# Altium project gtrack_anchor_v2.PrjPcb
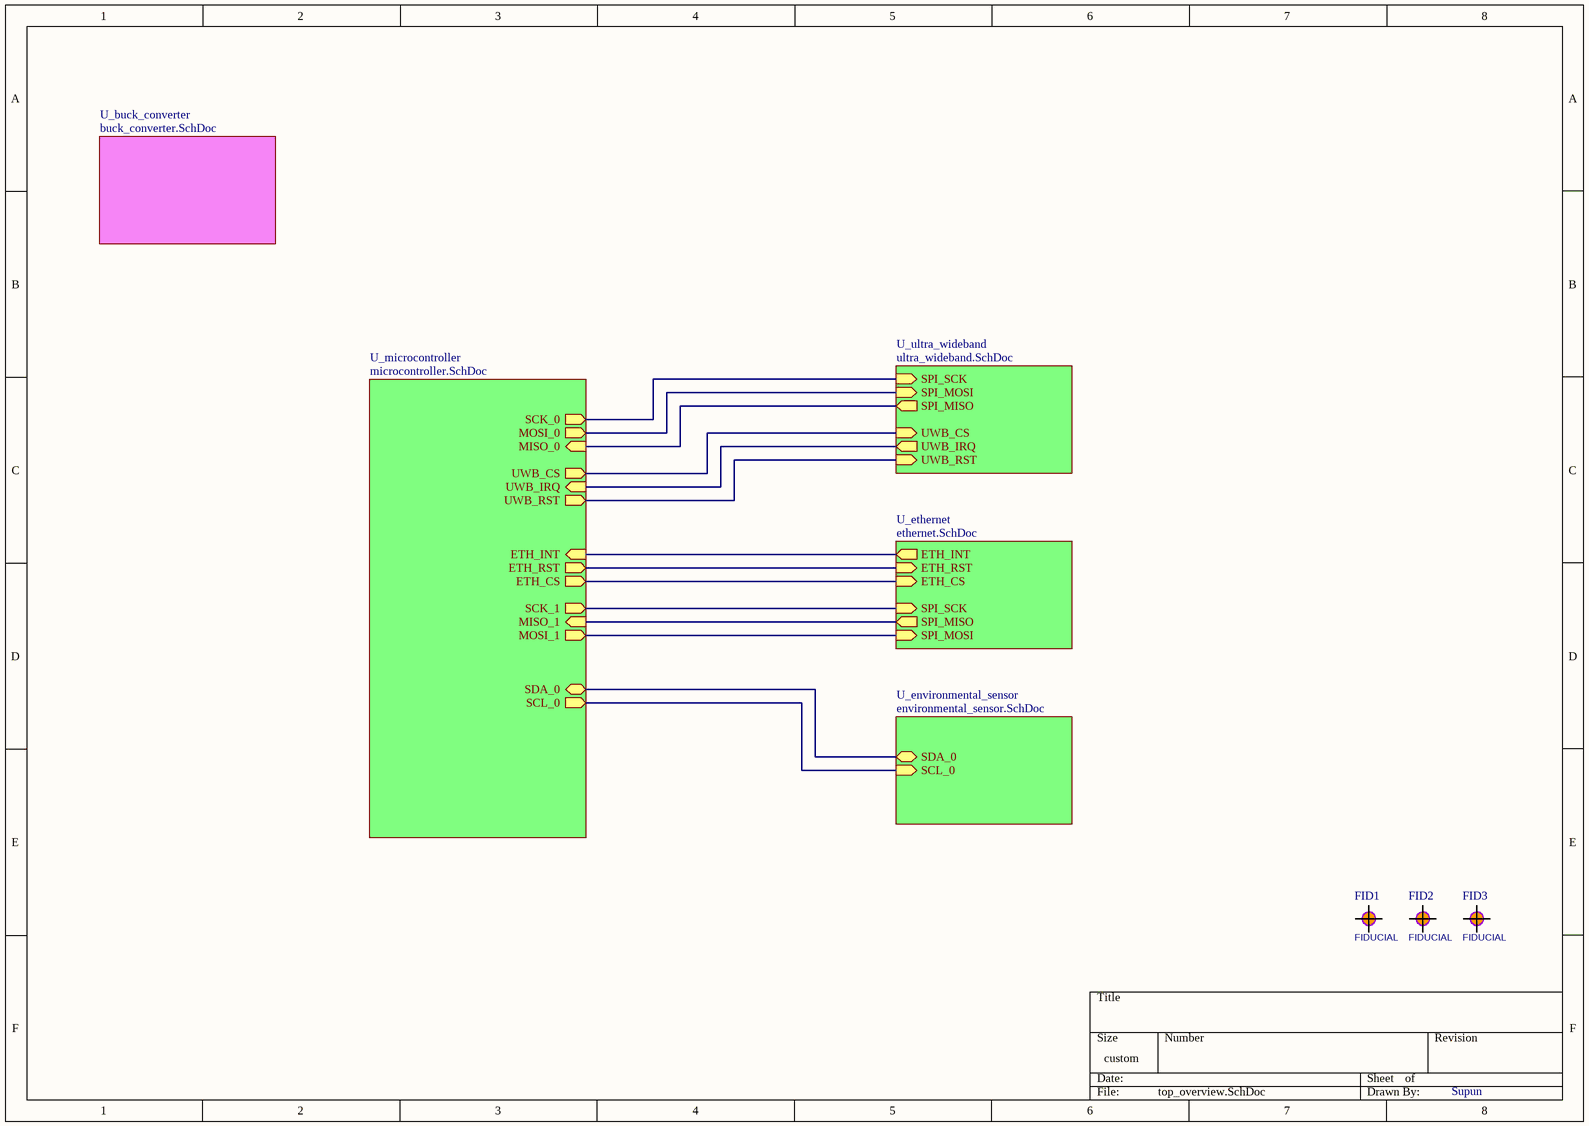
[diagram p0: top_overview.SchDoc]
6 sheets, 148 parts. Net scope: hierarchical (ports join the sheet entries above them; power ports are global).
Board file: GTrackAnchor_v2.PcbDoc
Sheets:
  top_overview.SchDoc
    U_microcontroller = microcontroller.SchDoc
    U_ultra_wideband = ultra_wideband.SchDoc
    U_ethernet = ethernet.SchDoc
    U_buck_converter = buck_converter.SchDoc
    U_environmental_sensor = environmental_sensor.SchDoc

## Sheet top_overview.SchDoc
size 297 x 209 mm; DrawnBy: Supun; Engineer: Supun; Organization: C3

### Parts
FID1  FIDUCIAL  [FIDUCIAL1SM2]  (no BOM)
FID2  FIDUCIAL  [FIDUCIAL1SM2]  (no BOM)
FID3  FIDUCIAL  [FIDUCIAL1SM2]  (no BOM)

### Sub-sheets
U_buck_converter = buck_converter.SchDoc: no entries
U_environmental_sensor = environmental_sensor.SchDoc: SDA_0 (bidir), SCL_0 (in)
U_ethernet = ethernet.SchDoc: ETH_INT (out), SPI_MISO (out), SPI_MOSI (in), ETH_RST (in), ETH_CS (in), SPI_SCK (in)
U_microcontroller = microcontroller.SchDoc: MISO_1 (in), MOSI_1 (out), SCK_1 (out), MOSI_0 (out), UWB_CS (out), SCK_0 (out), UWB_IRQ (in), UWB_RST (out), MISO_0 (in), ETH_INT (in), ETH_RST (out), SDA_0 (bidir), SCL_0 (out), ETH_CS (out)
U_ultra_wideband = ultra_wideband.SchDoc: SPI_MISO (out), UWB_IRQ (out), UWB_RST (in), UWB_CS (in), SPI_SCK (in), SPI_MOSI (in)

### Nets
ETH_CS: sheet U_microcontroller/ETH_CS, sheet U_ethernet/ETH_CS
ETH_INT: sheet U_microcontroller/ETH_INT, sheet U_ethernet/ETH_INT
ETH_RST: sheet U_microcontroller/ETH_RST, sheet U_ethernet/ETH_RST
MISO_0: sheet U_microcontroller/MISO_0, sheet U_ultra_wideband/SPI_MISO
MISO_1: sheet U_microcontroller/MISO_1, sheet U_ethernet/SPI_MISO
MOSI_0: sheet U_microcontroller/MOSI_0, sheet U_ultra_wideband/SPI_MOSI
MOSI_1: sheet U_microcontroller/MOSI_1, sheet U_ethernet/SPI_MOSI
SCK_0: sheet U_microcontroller/SCK_0, sheet U_ultra_wideband/SPI_SCK
SCK_1: sheet U_microcontroller/SCK_1, sheet U_ethernet/SPI_SCK
SCL_1: sheet U_microcontroller/SCL_0, sheet U_environmental_sensor/SCL_0
SDA_1: sheet U_microcontroller/SDA_0, sheet U_environmental_sensor/SDA_0
UWB_CS: sheet U_microcontroller/UWB_CS, sheet U_ultra_wideband/UWB_CS
UWB_IRQ: sheet U_microcontroller/UWB_IRQ, sheet U_ultra_wideband/UWB_IRQ
UWB_RST: sheet U_microcontroller/UWB_RST, sheet U_ultra_wideband/UWB_RST

### Notes on the sheet
- Title
- Size:
- Date:
- A4
- Number:
- Time:
- Revision:
- Sheet
- of
- File:

### Library data of the parts
FID1-FID3 = Fiducial: FIDUCIAL PCB ASSEMBLY AUTOMATED SMT; MF: SAH; ASSEMBLY: DNP; VALUE: FIDUCIAL

## Sheet microcontroller.SchDoc
size 297 x 209 mm; DrawnBy: Supun; Engineer: Supun; Organization: C3
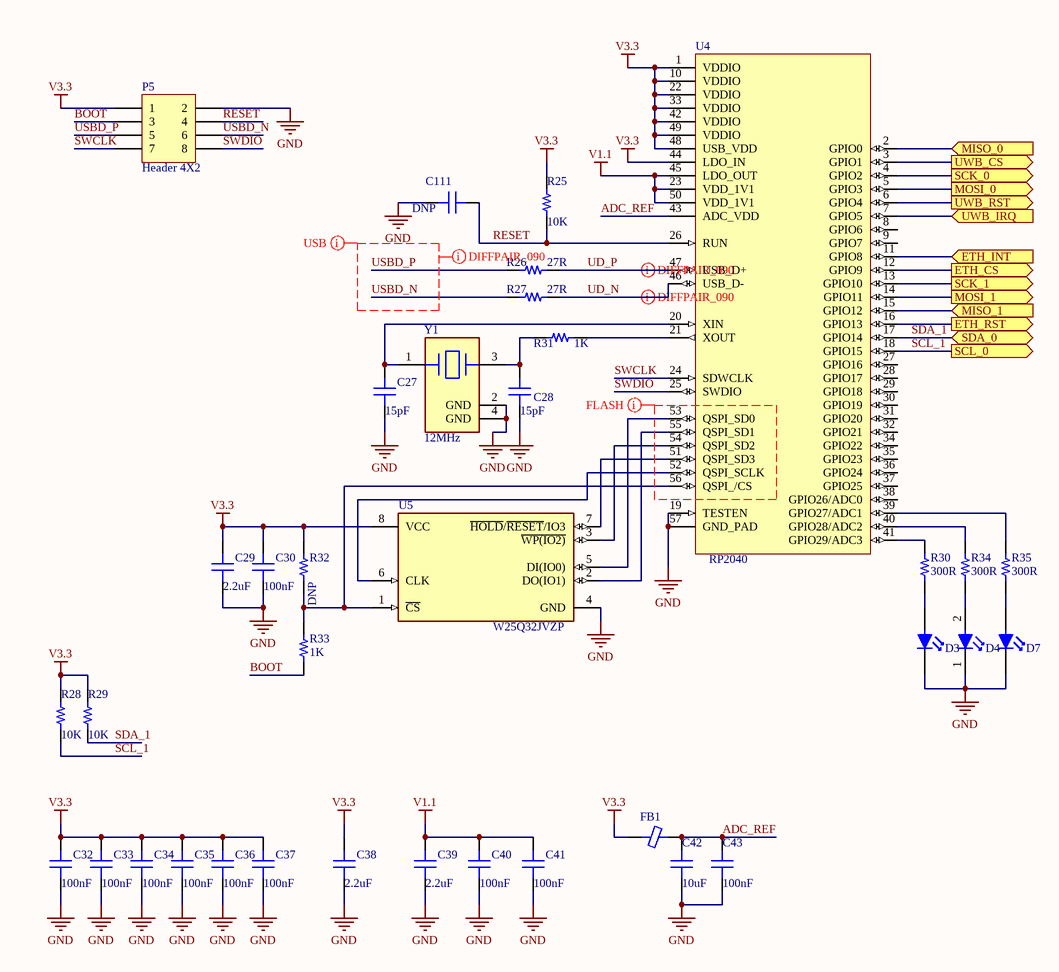
[diagram p1: microcontroller.SchDoc]

### Parts
C27  15pF  [CAP 0603_1608]
C28  15pF  [CAP 0603_1608]
C29  2.2uF  [CAP 0603_1608]
C30  100nF  [CAP 0603_1608]
C32  100nF  [CAP 0603_1608]
C33  100nF  [CAP 0603_1608]
C34  100nF  [CAP 0603_1608]
C35  100nF  [CAP 0603_1608]
C36  100nF  [CAP 0603_1608]
C37  100nF  [CAP 0603_1608]
C38  2.2uF  [CAP 0603_1608]
C39  2.2uF  [CAP 0603_1608]
C40  100nF  [CAP 0603_1608]
C41  100nF  [CAP 0603_1608]
C42  10uF  [CAP 0603_1608]
C43  100nF  [CAP 0603_1608]
C111  DNP  [CAP 0603_1608]
D3  Green  [Würth_Elektronik_0_MFG]  (value not drawn)
D4  Red  [Würth_Elektronik_0_MFG]  (value not drawn)
D7  Green  [Würth_Elektronik_0_MFG]  (value not drawn)
FB1  Ferrite Beads  [Murata_BLM18-0_15-t0_8_MFG]  (value not drawn)
P5  Header 4X2  [HDR2X4]
R25  10K  [RES 0603_1608]
R26  27R  [RES 0603_1608]
R27  27R  [RES 0603_1608]
R28  10K  [RES 0603_1608]
R29  10K  [RES 0603_1608]
R30  300R  [RES 0603_1608]
R31  1K  [RES 0603_1608]
R32  DNP  [RES 0603_1608]
R33  1K  [RES 0603_1608]
R34  300R  [RES 0603_1608]
R35  300R  [RES 0603_1608]
U4  RP2040  [RP2040-Footprint-1]
U5  W25Q32JVZP  [WINBOND WSON-8 6x5mm]
Y1  12MHz  [ABRACON ABM8G]

### Ports
ETH_CS (out), ETH_INT (in), ETH_RST (out), MISO_0 (in), MISO_1 (in), MOSI_0 (out), MOSI_1 (out), SCK_0 (out), SCK_1 (out), SCL_0 (out), SDA_0 (bidir), UWB_CS (out), UWB_IRQ (in), UWB_RST (out)

### Nets
GND: C27.1 C28.1 C29.2 C30.2 C32.2 C33.2 C34.2 C35.2 C36.2 C37.2 C38.2 C39.2 C40.2 C41.2 C42.2 C43.2 C111.1 D3.1(C) D4.1(C) D7.1(C) P5.2 U4.19(TESTEN) U4.57(GND_PAD) U5.4(GND) Y1.2(GND) Y1.4(GND)
V1.1: C39.1 C40.1 C41.1 U4.23(VDD_1V1) U4.45(LDO_OUT) U4.50(VDD_1V1)
V3.3: C29.1 C30.1 C32.1 C33.1 C34.1 C35.1 C36.1 C37.1 C38.1 FB1.1 P5.1 R25.2 R28.2 R29.2 R32.1 U4.1(VDDIO) U4.10(VDDIO) U4.22(VDDIO) U4.33(VDDIO) U4.42(VDDIO) U4.44(LDO_IN) U4.48(USB_VDD) U4.49(VDDIO) U5.8(VCC)
ADC_REF: C42.1 C43.1 FB1.2 U4.43(ADC_VDD)
BOOT: P5.3 R33.1
ETH_CS: U4.12(GPIO9) ; port ETH_CS
ETH_INT: U4.11(GPIO8) ; port ETH_INT
ETH_RST: U4.16(GPIO13) ; port ETH_RST
MISO_0: U4.2(GPIO0) ; port MISO_0
MISO_1: U4.15(GPIO12) ; port MISO_1
MOSI_0: U4.5(GPIO3) ; port MOSI_0
MOSI_1: U4.14(GPIO11) ; port MOSI_1
RESET: C111.2 P5.4 R25.1 U4.26(RUN)
SCK_0: U4.4(GPIO2) ; port SCK_0
SCK_1: U4.13(GPIO10) ; port SCK_1
SCL_1: R28.1 U4.18(GPIO15) ; port SCL_0
SDA_1: R29.1 U4.17(GPIO14) ; port SDA_0
SWCLK: P5.7 U4.24(SDWCLK)
SWDIO: P5.8 U4.25(SWDIO)
UD_N: R27.2 U4.46(USB_D-)
UD_P: R26.2 U4.47(USB_D+)
USBD_N: P5.6 R27.1
USBD_P: P5.5 R26.1
UWB_CS: U4.3(GPIO1) ; port UWB_CS
UWB_IRQ: U4.7(GPIO5) ; port UWB_IRQ
UWB_RST: U4.6(GPIO4) ; port UWB_RST
NetC27_2: C27.2 U4.20(XIN) Y1.1
NetC28_2: C28.2 R31.1 Y1.3
NetD3_2: D3.2(A) R30.2
NetD4_2: D4.2(A) R34.2
NetD7_2: D7.2(A) R35.1
NetR30_1: R30.1 U4.41(GPIO29/ADC3)
NetR31_2: R31.2 U4.21(XOUT)
NetR32_2: R32.2 R33.2 U4.56(QSPI_/CS) U5.1(~{CS})
NetR34_1: R34.1 U4.40(GPIO28/ADC2)
NetR35_2: R35.2 U4.39(GPIO27/ADC1)
NetU4_51: U4.51(QSPI_SD3) U5.7(~{HOLD}/~{RESET}/IO3)
NetU4_52: U4.52(QSPI_SCLK) U5.6(CLK)
NetU4_53: U4.53(QSPI_SD0) U5.5(DI(IO0))
NetU4_54: U4.54(QSPI_SD2) U5.3(~{WP(IO2)})
NetU4_55: U4.55(QSPI_SD1) U5.2(DO(IO1))

Not connected (* = marked no-connect by the designer): U4 8(GPIO6) 9(GPIO7) 27(GPIO16) 28(GPIO17) 29(GPIO18) 30(GPIO19) 31(GPIO20) 32(GPIO21) 34(GPIO22) 35(GPIO23) 36(GPIO24) 37(GPIO25) 38(GPIO26/ADC0)

### Layout directives
differential pair; differential pair class DIFF090: UD_N, UD_P, USBD_N, USBD_P
net class FLASH: (no net found under the mark)
net class USB: USBD_N, USBD_P

### Notes on the sheet
- Title
- Size:
- Date:
- A4
- Number:
- Time:
- Revision:
- Sheet
- of
- File:

### Library data of the parts
C27 C28 = Capacitor: SMT Capacitor; MF: Murata; MP: GRM1885C1H150JA01J; Value: 15pF; Link: https://www.mouser.com/ProductDetail/Murata-Electronics/GRM1885C1H150JA01J?qs=6X6%252BjuxzJaBd4%252Bvb3bD5Gw%3D%3D
C29 C38 C39 = Capacitor: SMT Capacitor; MF: Samsung; MP: CL10A225KP8NNNC; Value: 2.2uF; Link: https://www.mouser.com/ProductDetail/Samsung-Electro-Mechanics/CL10A225KP8NNNC?qs=hqM3L16%252Bxldb5UYUGQVB5Q%3D%3D
C30 C32-C37 C40 C41 C43 = Capacitor: SMT Capacitor; MF: TDK; MP: CGA3E2X7R1E104K080AA; Value: 100nF; Link: https://www.mouser.com/ProductDetail/TDK/CGA3E2X7R1E104K080AA?qs=NRhsANhppD%2Fm7%2FOmmsm0vg%3D%3D
C42 = Capacitor: SMT Capacitor; MF: Murata; MP: GRM188R61C106MAALD; Value: 10uF; Link: https://www.mouser.com/ProductDetail/Murata-Electronics/GRM188R61C106MAALD?qs=hNud%2FORuBR3LEOKZ4RJp9w%3D%3D
C111 = Capacitor: SMT Capacitor; MP: C0603C104K4PACTU; Value: DNP; Link: https://
D3 D7 = LED SMD: Led Diffused SMD; MF: LiteOn; MP: LTST-C190KGKT; Value: Green; Link: https://www.mouser.com/ProductDetail/Lite-On/LTST-C190KGKT?qs=205qCy6M2Q%252BAdcgwUZktqw%3D%3D
D4 = LED SMD: Led Diffused SMD; MF: LiteOn; MP: LTST-C190KRKT; Value: Red; Link: https://www.mouser.com/ProductDetail/Lite-On/LTST-C190KRKT?qs=kAD5fFa1n5VY3YYNWPC1Fg%3D%3D
FB1 = Ferrite Chip: SMT Ferrite Chip; MF: Murata; MP: BLM18PG471SN1D; Link: https://www.mouser.com/ProductDetail/Murata-Electronics/BLM18PG471SN1D?qs=EYzdjubb4S%2FN1Ip39GrHyg%3D%3D
P5 = Header 4X2: Header, 4-Pin, Dual row; LatestRevisionDate: 17-Jul-2002; LatestRevisionNote: Re-released for DXP Platform.; Publisher: Altium Limited
R25 R28 R29 = Resistor: SMT Resistor; MF: YAGEO; MP: AC0603FR-0710KL; Value: 10K; Link: https://www.mouser.com/ProductDetail/YAGEO/AC0603FR-0710KL?qs=UoPT7wUmgYKz3zh0UDMA4Q%3D%3D
R26 R27 = Resistor: SMT Resistor; MF: YAGEO; MP: AC0603FR-0727RL; Value: 27R; Link: https://www.mouser.com/ProductDetail/YAGEO/AC0603FR-0727RL?qs=yhV1fb9g%2FKZSwVP2Wqwqfg%3D%3D
R30 R34 R35 = Resistor: SMT Resistor; MF: YAGEO; MP: AC0603FR-07300RL; Value: 300R; Link: https://www.mouser.com/ProductDetail/YAGEO/AC0603FR-07300RL?qs=yhV1fb9g%2FKYRCKndxB9juA%3D%3D
R31 R33 = Resistor: SMT Resistor; MF: YAGEO; MP: AC0603FR-071KL; Value: 1K; Link: https://www.mouser.com/ProductDetail/YAGEO/AC0603FR-071KL?qs=UoPT7wUmgYJx4gI0q%252BcIRQ%3D%3D
R32 = Resistor: SMT Resistor; MF: *; MP: *; Value: DNP; Link: https://
U4 = RP2040: ARM® Cortex®-M0+ series Microcontroller IC 32-Bit Dual-Core 133MHz 16MB (16M x 8) FLASH 56-QFN (7x7); MF: Raspberry Pi; MP: RP2040TR13; Link: https://www.digikey.com/en/products/detail/raspberry-pi/SC0914-13/14306010
U5 = W25Q32JVZP: 3V 32M-BIT SERIAL FLASH MEMORY WITH DUAL, QUAD SPI; MF: Winbond; MP: W25Q32JVZPIQ; Value: *; Link: https://www.mouser.com/ProductDetail/Winbond/W25Q32JVZPIQ?qs=qSfuJ%252Bfl%2Fd5Ca0jgzBVqQA%3D%3D
Y1 = Crystal: Crystals AEC-Q200 CRYSTAL 4pin SMD; MF: ECS; MP: ECS-120-12-33-AGN-TR; Value: 12MHz; Link: https://www.mouser.com/ProductDetail/ECS/ECS-120-12-33-AGN-TR?qs=wd5RIQLrsJj7GY%252BaXCrd3A%3D%3D

## Sheet ultra_wideband.SchDoc
size 297 x 209 mm; DrawnBy: Supun; Engineer: Supun; Organization: C3
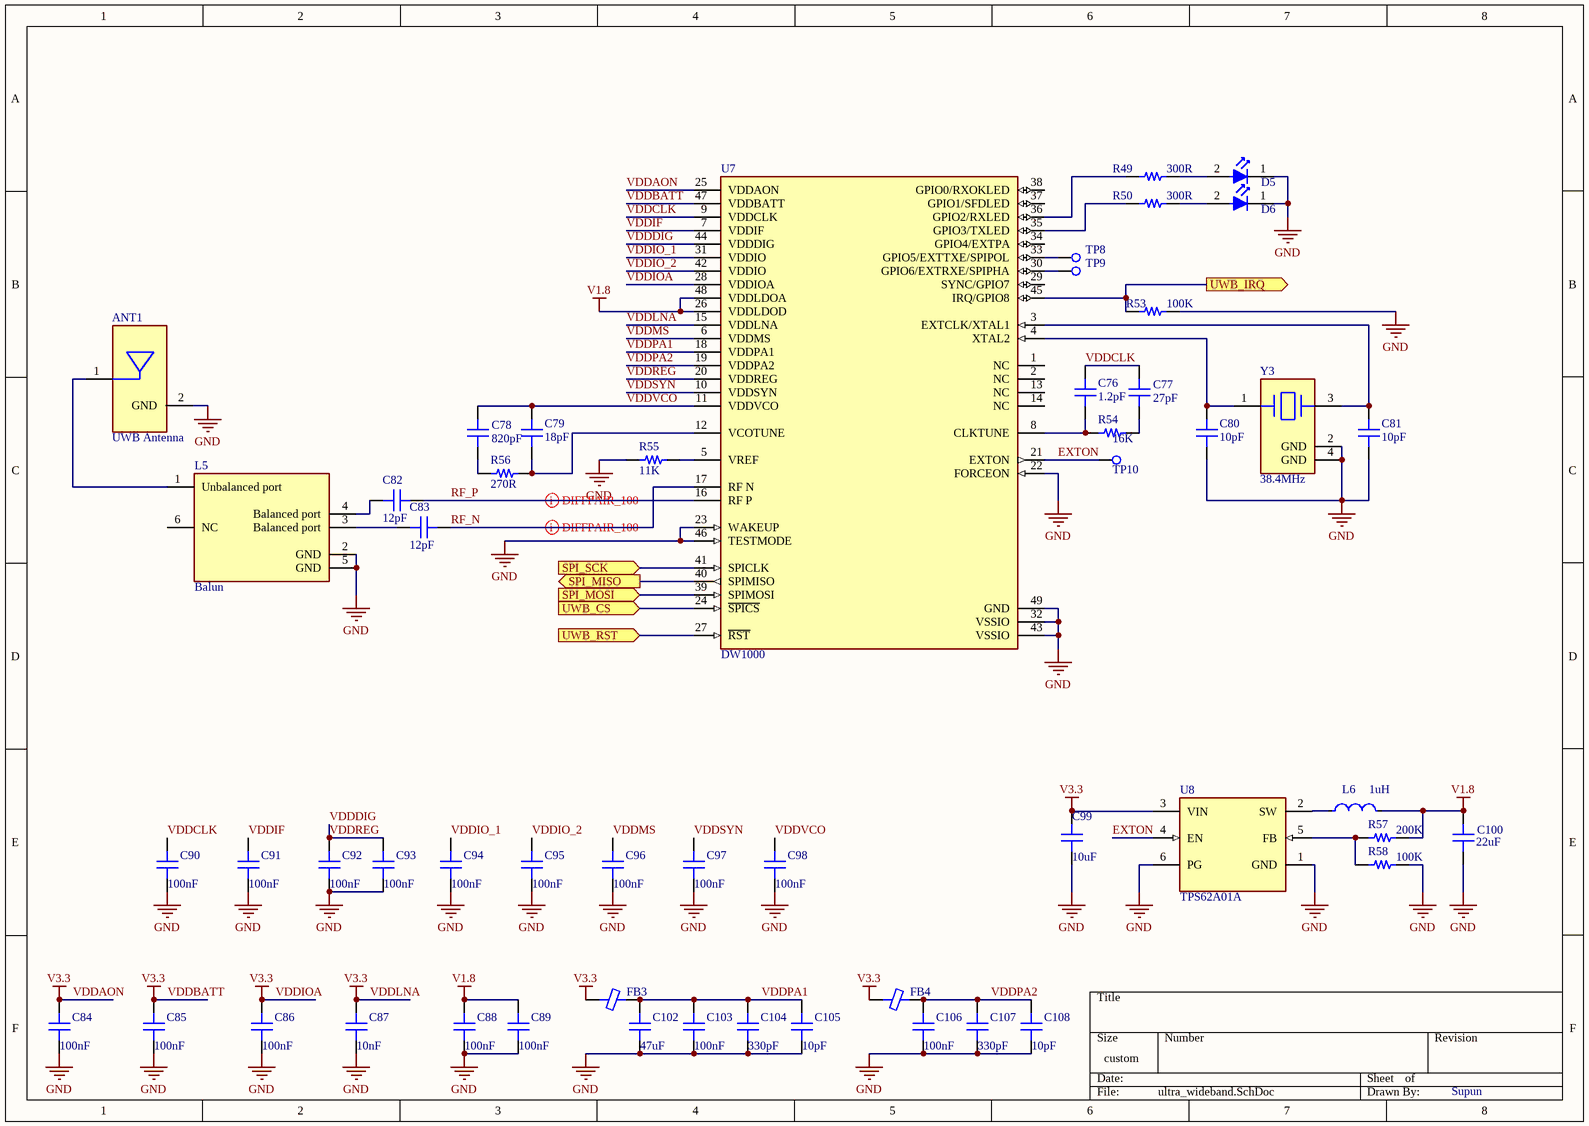
[diagram p2: ultra_wideband.SchDoc]

### Parts
ANT1  UWB Antenna  [UWB_ANTENNA_1]
C76  1.2pF  [CAP 0603_1608]
C77  27pF  [CAP 0603_1608]
C78  820pF  [CAP 0603_1608]
C79  18pF  [CAP 0603_1608]
C80  10pF  [CAP 0603_1608]
C81  10pF  [CAP 0603_1608]
C82  12pF  [CAP 0603_1608]
C83  12pF  [CAP 0603_1608]
C84  100nF  [CAP 0603_1608]
C85  100nF  [CAP 0603_1608]
C86  100nF  [CAP 0603_1608]
C87  10nF  [CAP 0603_1608]
C88  100nF  [CAP 0603_1608]
C89  100nF  [CAP 0603_1608]
C90  100nF  [CAP 0603_1608]
C91  100nF  [CAP 0603_1608]
C92  100nF  [CAP 0603_1608]
C93  100nF  [CAP 0603_1608]
C94  100nF  [CAP 0603_1608]
C95  100nF  [CAP 0603_1608]
C96  100nF  [CAP 0603_1608]
C97  100nF  [CAP 0603_1608]
C98  100nF  [CAP 0603_1608]
C99  10uF  [CAP 0603_1608]
C100  22uF  [CAP 0603_1608]
C102  47uF  [CAP 0603_1608]
C103  100nF  [CAP 0603_1608]
C104  330pF  [CAP 0603_1608]
C105  10pF  [CAP 0603_1608]
C106  100nF  [CAP 0603_1608]
C107  330pF  [CAP 0603_1608]
C108  10pF  [CAP 0603_1608]
D5  Green  [Würth_Elektronik_0_MFG]  (value not drawn)
D6  Red  [Würth_Elektronik_0_MFG]  (value not drawn)
FB3  Ferrite Beads  [Murata_BLM18-0_15-t0_8_MFG]  (value not drawn)
FB4  Ferrite Beads  [Murata_BLM18-0_15-t0_8_MFG]  (value not drawn)
L5  Balun  [TDK_HHM1595A1_MFG]
L6  1uH  [IND 1008_2520]
R49  300R  [RES 0603_1608]
R50  300R  [RES 0603_1608]
R53  100K  [RES 0603_1608]
R54  16K  [RES 0603_1608]
R55  11K  [RES 0603_1608]
R56  270R  [RES 0603_1608]
R57  200K  [RES 0603_1608]
R58  100K  [RES 0603_1608]
TP8  Test Point  [TPSMD_S1]  (value not drawn)
TP9  Test Point  [TPSMD_S1]  (value not drawn)
TP10  Test Point  [TPSMD_S1]  (value not drawn)
U7  DW1000  [Qorvo_1_IPC_B]
U8  TPS62A01A  [TI SOT-563 DRL]
Y3  38.4MHz  [ABRACON ABM8G]

### Ports
SPI_MISO (out), SPI_MOSI (in), SPI_SCK (in), UWB_CS (in), UWB_IRQ (out), UWB_RST (in)

### Nets
GND: ANT1.2(GND) C80.1 C81.1 C84.2 C85.2 C86.2 C87.2 C88.2 C89.2 C90.2 C91.2 C92.2 C93.2 C94.2 C95.2 C96.2 C97.2 C98.2 C99.2 C100.2 C102.1 C103.2 C104.1 C105.1 C106.2 C107.1 C108.1 D5.1(C) D6.1(C) L5.2(GND) L5.5(GND) R53.1 R55.1 R58.2 U7.22(FORCEON) U7.23(WAKEUP) U7.32(VSSIO) U7.43(VSSIO) U7.46(TESTMODE) U7.49(GND) U8.1(GND) U8.6(PG) Y3.2(GND) Y3.4(GND)
V1.8: C88.1 C89.1 C100.1 L6.2 R57.2 U7.26(VDDLDOD) U7.48(VDDLDOA)
V3.3: C84.1 C85.1 C86.1 C87.1 C99.1 FB3.1 FB4.1 U7.15(VDDLNA) U7.25(VDDAON) U7.28(VDDIOA) U7.47(VDDBATT) U8.3(VIN)  [also labelled VDDAON, VDDBATT, VDDIOA, VDDLNA]
EXTON: TP10.1(TP) U7.21(EXTON) U8.4(EN)
MISO_0: U7.40(SPIMISO) ; port SPI_MISO
MOSI_0: U7.39(SPIMOSI) ; port SPI_MOSI
RF_N: C83.1 U7.17(RF_N)
RF_P: C82.1 U7.16(RF_P)
SCK_0: U7.41(SPICLK) ; port SPI_SCK
UWB_CS: U7.24(~{SPICS}) ; port UWB_CS
UWB_IRQ: R53.2 U7.45(IRQ/GPIO8) ; port UWB_IRQ
UWB_RST: U7.27(~{RST}) ; port UWB_RST
VDDCLK: C76.2 C77.2 C90.1 U7.9(VDDCLK)
VDDDIG: C92.1 C93.1 U7.20(VDDREG) U7.44(VDDDIG)  [also labelled VDDREG]
VDDIF: C91.1 U7.7(VDDIF)
VDDIO_1: C94.1 U7.31(VDDIO)
VDDIO_2: C95.1 U7.42(VDDIO)
VDDMS: C96.1 U7.6(VDDMS)
VDDPA1: C102.2 C103.1 C104.2 C105.2 FB3.2 U7.18(VDDPA1)
VDDPA2: C106.1 C107.2 C108.2 FB4.2 U7.19(VDDPA2)
VDDSYN: C97.1 U7.10(VDDSYN)
VDDVCO: C78.2 C79.2 C98.1 U7.11(VDDVCO)
NetANT1_1: ANT1.1 L5.1(Unbalanced_port)
NetC76_1: C76.1 R54.2 U7.8(CLKTUNE)
NetC77_1: C77.1 R54.1
NetC78_1: C78.1 R56.2
NetC79_1: C79.1 R56.1 U7.12(VCOTUNE)
NetC80_2: C80.2 U7.4(XTAL2) Y3.1
NetC81_2: C81.2 U7.3(EXTCLK/XTAL1) Y3.3
NetC82_2: C82.2 L5.4(Balanced_port)
NetC83_2: C83.2 L5.3(Balanced_port)
NetD5_2: D5.2(A) R49.2
NetD6_2: D6.2(A) R50.2
NetL6_1: L6.1 U8.2(SW)
NetR49_1: R49.1 U7.36(GPIO2/RXLED)
NetR50_1: R50.1 U7.35(GPIO3/TXLED)
NetR55_2: R55.2 U7.5(VREF)
NetR57_1: R57.1 R58.1 U8.5(FB)
NetTP8_1: TP8.1(TP) U7.33(GPIO5/EXTTXE/SPIPOL)
NetTP9_1: TP9.1(TP) U7.30(GPIO6/EXTRXE/SPIPHA)

Not connected (* = marked no-connect by the designer): L5 6(NC); U7 1(NC) 2(NC) 13(NC) 14(NC) 29(SYNC/GPIO7) 34(GPIO4/EXTPA) 37(GPIO1/SFDLED) 38(GPIO0/RXOKLED)

### Layout directives
differential pair; differential pair class DIFF100: RF_N, RF_P

### Notes on the sheet
- Title
- Size:
- Date:
- A4
- Number:
- Time:
- Revision:
- Sheet
- of
- File:

### Library data of the parts
ANT1 = UWB PCB Antenna: PCB Antenna; MF: SAH; MP: *; Value: *
C76 = Capacitor: SMT Capacitor; MF: Murata; MP: GRM1885C1H1R2CA01D; Value: 1.2pF; Link: https://www.mouser.com/ProductDetail/Murata-Electronics/GRM1885C1H1R2CA01D?qs=9yYqngZLNofO2BzK0fMtoQ%3D%3D
C77 = Capacitor: SMT Capacitor; MF: Murata; MP: GRM1885C1H270JA01D; Value: 27pF; Link: https://www.mouser.com/ProductDetail/Murata-Electronics/GRM1885C1H270JA01D?qs=Mti35kkwCSM3XwxonqPhaQ%3D%3D
C78 = Capacitor: SMT Capacitor; MF: Murata; MP: GRM1885C1H821JA01D; Value: 820pF; Link: https://www.mouser.com/ProductDetail/Murata-Electronics/GRM1885C1H821JA01D?qs=2MiASeLb%252BOD2kFngltnvvA%3D%3D
C79 = Capacitor: SMT Capacitor; MF: Murata; MP: GRM1885C1H180JA01J; Value: 18pF; Link: https://www.mouser.com/ProductDetail/Murata-Electronics/GRM1885C1H180JA01J?qs=9Cj2FLRihcNL8A7ng%252BzQpQ%3D%3D
C80 C81 C105 C108 = Capacitor: SMT Capacitor; MF: Murata; MP: GRM1885C1H100GA01D; Value: 10pF
  C80 C81: Link: https://www.mouser.com/ProductDetail/Murata-Electronics/GRM1885C1H100GA01D?qs=7Aw3Ng%2FBaE5snYvHxKANnw%3D%3D
  C105 C108: Link: https://
C82 C83 = Capacitor: SMT Capacitor; MF: Murata; MP: GRM1885C1H120JA01J; Value: 12pF; Link: https://www.mouser.com/ProductDetail/Murata-Electronics/GRM1885C1H120JA01J?qs=6X6%252BjuxzJaDbS6LwzBiDtw%3D%3D
C84-C86 C88-C98 C103 C106 = Capacitor: as C30 on sheet microcontroller; Value: 100nF; Link: https://www.mouser.com/ProductDetail/TDK/CGA3E2X7R1E104K080AA?qs=NRhsANhppD%2Fm7%2FOmmsm0vg%3D%3D
C87 = Capacitor: SMT Capacitor; MF: Murata; MP: GRM1885C1E103JA01D; Value: 10nF; Link: https://www.mouser.com/ProductDetail/Murata-Electronics/GRM1885C1E103JA01D?qs=ui%252B2d9lVEI4mHR%2FJ9wCzmw%3D%3D
C99 = Capacitor: as C42 on sheet microcontroller; Value: 10uF; Link: https://www.mouser.com/ProductDetail/Murata-Electronics/GRM188R61C106MAALD?qs=hNud%2FORuBR3LEOKZ4RJp9w%3D%3D
C100 = Capacitor: SMT Capacitor; MF: Murata; MP: GRM188R61A226ME15D; Value: 22uF; Link: https://www.mouser.com/ProductDetail/Murata-Electronics/GRM188R61A226ME15D?qs=eeBpzGFlv%252B8DV%2FrilzyhAw%3D%3D
C102 = Capacitor: SMT Capacitor; MF: Murata; MP: GRM188R60J476ME15D; Value: 47uF; Link: https://www.mouser.com/ProductDetail/Murata-Electronics/GRM188R60J476ME15D?qs=AEetWsPH0It1A1GvJsMuyQ%3D%3D
C104 C107 = Capacitor: SMT Capacitor; MF: Murata; MP: GRM1885C1H331JA01D; Value: 330pF; Link: https://www.mouser.com/ProductDetail/Murata-Electronics/GRM1885C1H331JA01D?qs=DiwnqUvG%2FIUYCCwNVhuo3w%3D%3D
D5 = LED SMD: as D3 on sheet microcontroller; Value: Green; Link: https://www.mouser.com/ProductDetail/Lite-On/LTST-C190KGKT?qs=205qCy6M2Q%252BAdcgwUZktqw%3D%3D
D6 = LED SMD: as D4 on sheet microcontroller; Value: Red; Link: https://www.mouser.com/ProductDetail/Lite-On/LTST-C190KRKT?qs=kAD5fFa1n5VY3YYNWPC1Fg%3D%3D
FB3 FB4 = Ferrite Chip: SMT Ferrite Chip; MF: Murata; MP: BLM18AG601SH1D; Link: https://www.mouser.com/ProductDetail/Murata-Electronics/BLM18AG601SH1D?qs=L3QzcrVjv97OjVi99nCgnA%3D%3D
L5 = HHM1595A1: Signal Conditioning LTCC BALUN 3000-8000MHz; MF: TDK; MP: HHM1595A1; Value: Balun; Link: https://www.mouser.com/ProductDetail/TDK/HHM1595A1?qs=CQ%2FIPMfstfij2T2%252BDRqDhg%3D%3D
L6 = Inductor_sm: Fixed Inductors 2.2uH 20% High Temp AEC-Q200; MF: Murata; MP: DFE252012F-1R0M=P2; Value: 1uH; Link: https://www.mouser.com/ProductDetail/Murata-Electronics/DFE252012F-1R0M%3dP2?qs=ty6qhqyUUEtPvXJAIo0Pnw%3D%3D
R49 R50 = Resistor: as R30 on sheet microcontroller; Value: 300R; Link: https://www.mouser.com/ProductDetail/YAGEO/AC0603FR-07300RL?qs=yhV1fb9g%2FKYRCKndxB9juA%3D%3D
R53 R58 = Resistor: SMT Resistor; MF: YAGEO; MP: AC0603FR-07100KL; Value: 100K; Link: https://www.mouser.com/ProductDetail/YAGEO/AC0603FR-07100KL?qs=UoPT7wUmgYKBKZ83mTH%252BSA%3D%3D
R54 = Resistor: SMT Resistor; MF: YAGEO; MP: AC0603FR-0716KL; Value: 16K; Link: https://www.mouser.com/ProductDetail/YAGEO/AC0603FR-0716KL?qs=yhV1fb9g%2FKbveWp4BLOPMQ%3D%3D
R55 = Resistor: SMT Resistor; MF: YAGEO; MP: AC0603FR-0711KL; Value: 11K; Link: https://www.mouser.com/ProductDetail/YAGEO/AC0603FR-0711KL?qs=yhV1fb9g%2FKb4ptOMRzX2uQ%3D%3D
R56 = Resistor: SMT Resistor; MF: YAGEO; MP: AC0603FR-07270RL; Value: 270R; Link: https://www.mouser.com/ProductDetail/YAGEO/AC0603FR-07270RL?qs=yhV1fb9g%2FKYFLWtESjiWpg%3D%3D
R57 = Resistor: SMT Resistor; MF: YAGEO; MP: AC0603FR-07200KL; Value: 200K; Link: https://www.mouser.com/ProductDetail/YAGEO/AC0603FR-07200KL?qs=sGAEpiMZZMvdGkrng054t2uy2SOblyUPuZUSlNzrwrw%3D
U7 = DW1000: Fully integrated Ultra Wideband (UWB) transceiver IC, IEEE802.15.4-2011, 2-way ranging or TDoA, up to 6.8 Mbps; MF: Qorvo; MP: DW1000-I-TR13; Parameter 1: *; Link: https://www.mouser.com/ProductDetail/Qorvo/DW1000-I-TR13?qs=TiOZkKH1s2SHqHtNDSAfuQ%3D%3D
U8 = TPS62A01A: Switching Voltage Regulators 2.5-V to 5.5-V input, 1-A high-efficiency step-down converter with forced PWM in SOT-563 package; MF: Texas Instruments; MP: TPS62A01ADRLR; Link: https://www.mouser.com/ProductDetail/Texas-Instruments/TPS62A01ADRLR?qs=tlsG%2FOw5FFjxQ1CGo801Kw%3D%3D
Y3 = Crystal: Crystals AEC-Q200 CRYSTAL 4pin SMD; MF: ECS; MP: ECS-384-10-33B-CKY-TR; Value: 38.4MHz; Link: https://www.mouser.com/ProductDetail/ECS/ECS-384-10-33B-CKY-TR?qs=wd5RIQLrsJh9q4Mm6EsgEw%3D%3D
TP8-TP10 = Test Point: Link: https://

## Sheet ethernet.SchDoc
size 297 x 209 mm; DrawnBy: Supun; Engineer: Supun; Organization: C3
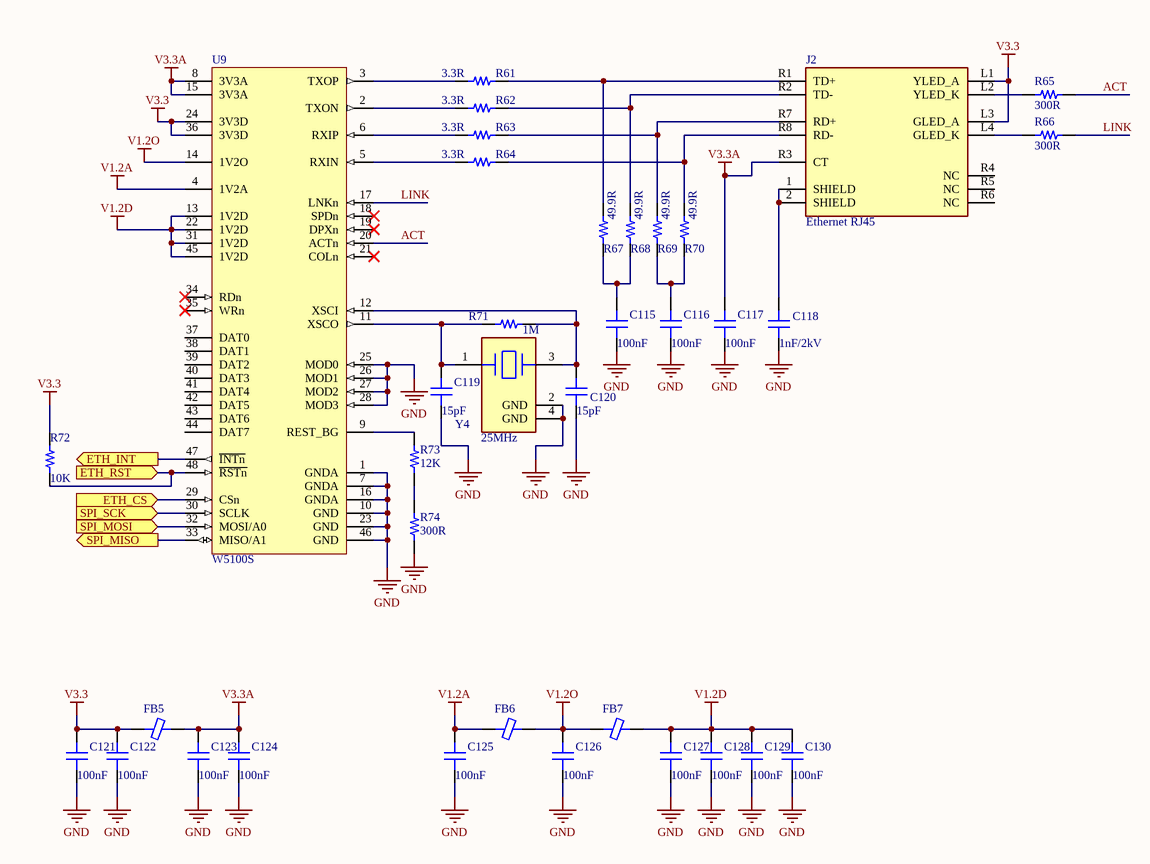
[diagram p3: ethernet.SchDoc]

### Parts
C115  100nF  [CAP 0603_1608]
C116  100nF  [CAP 0603_1608]
C117  100nF  [CAP 0603_1608]
C118  1nF/2kV  [CAP 1206_3216]
C119  15pF  [CAP 0603_1608]
C120  15pF  [CAP 0603_1608]
C121  100nF  [CAP 0603_1608]
C122  100nF  [CAP 0603_1608]
C123  100nF  [CAP 0603_1608]
C124  100nF  [CAP 0603_1608]
C125  100nF  [CAP 0603_1608]
C126  100nF  [CAP 0603_1608]
C127  100nF  [CAP 0603_1608]
C128  100nF  [CAP 0603_1608]
C129  100nF  [CAP 0603_1608]
C130  100nF  [CAP 0603_1608]
FB5  Ferrite Beads  [Murata_BLM18-0_15-t0_8_MFG]  (value not drawn)
FB6  Ferrite Beads  [Murata_BLM18-0_15-t0_8_MFG]  (value not drawn)
FB7  Ferrite Beads  [Murata_BLM18-0_15-t0_8_MFG]  (value not drawn)
J2  Ethernet RJ45  [WIZnet_RB1-125BAG1A_0]
R61  3.3R  [RES 0603_1608]
R62  3.3R  [RES 0603_1608]
R63  3.3R  [RES 0603_1608]
R64  3.3R  [RES 0603_1608]
R65  300R  [RES 0603_1608]
R66  300R  [RES 0603_1608]
R67  49.9R  [RES 0603_1608]
R68  49.9R  [RES 0603_1608]
R69  49.9R  [RES 0603_1608]
R70  49.9R  [RES 0603_1608]
R71  1M  [RES 0603_1608]
R72  10K  [RES 0603_1608]
R73  12K  [RES 0603_1608]
R74  300R  [RES 0603_1608]
U9  W5100S  [WIZ-W5500-LQFP-48_N]
Y4  25MHz  [ABRACON ABM8G]

### Ports
ETH_CS (in), ETH_INT (out), ETH_RST (in), SPI_MISO (out), SPI_MOSI (in), SPI_SCK (in)

### Nets
GND: C115.2 C116.2 C117.2 C118.1 C119.1 C120.1 C121.2 C122.2 C123.2 C124.2 C125.2 C126.2 C127.2 C128.2 C129.2 C130.2 R74.1 U9.1(GNDA) U9.7(GNDA) U9.10(GND) U9.16(GNDA) U9.23(GND) U9.25(MOD0) U9.26(MOD1) U9.27(MOD2) U9.28(MOD3) U9.46(GND) Y4.2(GND) Y4.4(GND)
V1.2A: C125.1 FB6.1 U9.4(1V2A)
V1.2D: C127.1 C128.1 C129.1 C130.1 FB7.2 U9.13(1V2D) U9.22(1V2D) U9.31(1V2D) U9.45(1V2D)
V1.2O: C126.1 FB6.2 FB7.1 U9.14(1V2O)
V3.3: C121.1 C122.1 FB5.1 J2.L1(YLED_A) J2.L3(GLED_A) R72.2 U9.24(3V3D) U9.36(3V3D)
V3.3A: C117.1 C123.1 C124.1 FB5.2 J2.R3(CT) U9.8(3V3A) U9.15(3V3A)
ACT: R65.2 U9.20(ACTn)
ETH_CS: U9.29(CSn) ; port ETH_CS
ETH_INT: U9.47(~{INTn}) ; port ETH_INT
ETH_RST: R72.1 U9.48(~{RSTn}) ; port ETH_RST
LINK: R66.2 U9.17(LNKn)
MISO_1: U9.33(MISO/A1) ; port SPI_MISO
MOSI_1: U9.32(MOSI/A0) ; port SPI_MOSI
SCK_1: U9.30(SCLK) ; port SPI_SCK
NetC115_1: C115.1 R67.1 R68.1
NetC116_1: C116.1 R69.1 R70.1
NetC118_2: C118.2 J2.1(SHIELD) J2.2(SHIELD)
NetC119_2: C119.2 R71.2 U9.11(XSCO) Y4.1
NetC120_2: C120.2 R71.1 U9.12(XSCI) Y4.3
NetJ2_L2: J2.L2(YLED_K) R65.1
NetJ2_L4: J2.L4(GLED_K) R66.1
NetJ2_R1: J2.R1(TD+) R61.2 R67.2
NetJ2_R2: J2.R2(TD-) R62.2 R68.2
NetJ2_R7: J2.R7(RD+) R63.2 R69.2
NetJ2_R8: J2.R8(RD-) R64.2 R70.2
NetR61_1: R61.1 U9.3(TXOP)
NetR62_1: R62.1 U9.2(TXON)
NetR63_1: R63.1 U9.6(RXIP)
NetR64_1: R64.1 U9.5(RXIN)
NetR73_1: R73.1 R74.2
NetR73_2: R73.2 U9.9(REST_BG)

Not connected (* = marked no-connect by the designer): J2 R4(NC) R5(NC) R6(NC); U9 18(SPDn)* 19(DPXn)* 21(COLn)* 34(RDn)* 35(WRn)* 37(DAT0) 38(DAT1) 39(DAT2) 40(DAT3) 41(DAT4) 42(DAT5) 43(DAT6) 44(DAT7)

### Notes on the sheet
- Title
- Size:
- Date:
- A4
- Number:
- Time:
- Revision:
- Sheet
- of
- File:

### Library data of the parts
C115-C117 C121-C130 = Capacitor: as C30 on sheet microcontroller; Value: 100nF; Link: https://www.mouser.com/ProductDetail/TDK/CGA3E2X7R1E104K080AA?qs=NRhsANhppD%2Fm7%2FOmmsm0vg%3D%3D
C118 = Capacitor: SMT Capacitor; MF: KEMET; MP: C1206C102KGRAC; Value: 1nF/2kV; Link: https://www.mouser.com/ProductDetail/KEMET/C1206C102KGRAC?qs=1RE3cBpaOWtt6EeFSGrZqA%3D%3D
C119 C120 = Capacitor: as C27 on sheet microcontroller; Value: 15pF; Link: https://www.mouser.com/ProductDetail/Murata-Electronics/GRM1885C1H150JA01J?qs=6X6%252BjuxzJaBd4%252Bvb3bD5Gw%3D%3D
FB5-FB7 = Ferrite Chip: SMT Ferrite Chip; MF: TDK; MP: MAF1608GAD601CT000; Value: *; Link: https://www.mouser.com/ProductDetail/TDK/MAF1608GAD601CT000?qs=ahcBuItHZ3yA8sILv6RqMA%3D%3D
J2 = Ethernet RJ45: Modular Connectors / Ethernet Connectors RJ-45 w/ Transformer connector/ude; MF: WIZnet; MP: RB1-125BAG1A; Value: *; Link: https://www.mouser.com/ProductDetail/WIZnet/RB1-125BAG1A?qs=K8aI8m0%252Bj2HL3CgJHC4yWQ%3D%3D
R61-R64 = Resistor: SMT Resistor; MF: YAGEO; MP: AC0603FR-073R3L; Value: 3.3R; Link: https://www.mouser.com/ProductDetail/YAGEO/AC0603FR-073R3L?qs=sGAEpiMZZMvdGkrng054t3GzUHVMl1Seuwtsq%2FmjAJLJc5%252B9y23KyA%3D%3D
R65 R66 R74 = Resistor: as R30 on sheet microcontroller; Value: 300R; Link: https://www.mouser.com/ProductDetail/YAGEO/AC0603FR-07300RL?qs=yhV1fb9g%2FKYRCKndxB9juA%3D%3D
R67-R70 = Resistor: SMT Resistor; MF: YAGEO; MP: AC0603FR-0749R9L; Value: 49.9R; Link: https://www.mouser.com/ProductDetail/YAGEO/AC0603FR-0749R9L?qs=ygRr%2FtkhteuuNLaoU8EXeQ%3D%3D
R71 = Resistor: SMT Resistor; MF: YAGEO; MP: AC0603FR-071ML; Value: 1M; Link: https://www.mouser.com/ProductDetail/YAGEO/AC0603FR-071ML?qs=UoPT7wUmgYLqjUDINK%252BbdQ%3D%3D
R72 = Resistor: as R25 on sheet microcontroller; Value: 10K; Link: https://www.mouser.com/ProductDetail/YAGEO/AC0603FR-0710KL?qs=UoPT7wUmgYKz3zh0UDMA4Q%3D%3D
R73 = Resistor: SMT Resistor; MF: YAGEO; MP: AC0603FR-0712KL; Value: 12K; Link: https://www.mouser.com/ProductDetail/YAGEO/AC0603FR-0712KL?qs=yhV1fb9g%2FKamCgqiemhojw%3D%3D
U9 = W5100S: Ethernet ICs 10/100 Base-T/TX PHY SPI Interface 7x7; MF: WIZnet; MP: W5100S-L; Value: *; Link: https://www.mouser.com/ProductDetail/WIZnet/W5100S-L?qs=wnTfsH77Xs6eczkKf5LdDg%3D%3D
Y4 = Crystal: Crystals AEC-Q200 CRYSTAL 4pin SMD; MF: ECS; MP: ECS-250-12-33-AGN-TR3; Value: 25MHz; Link: https://www.mouser.com/ProductDetail/ECS/ECS-250-12-33-AGN-TR3?qs=e8oIoAS2J1QPB2oXa%2FBSbw%3D%3D

## Sheet buck_converter.SchDoc
size 297 x 209 mm; DrawnBy: Supun; Engineer: Supun; Organization: C3
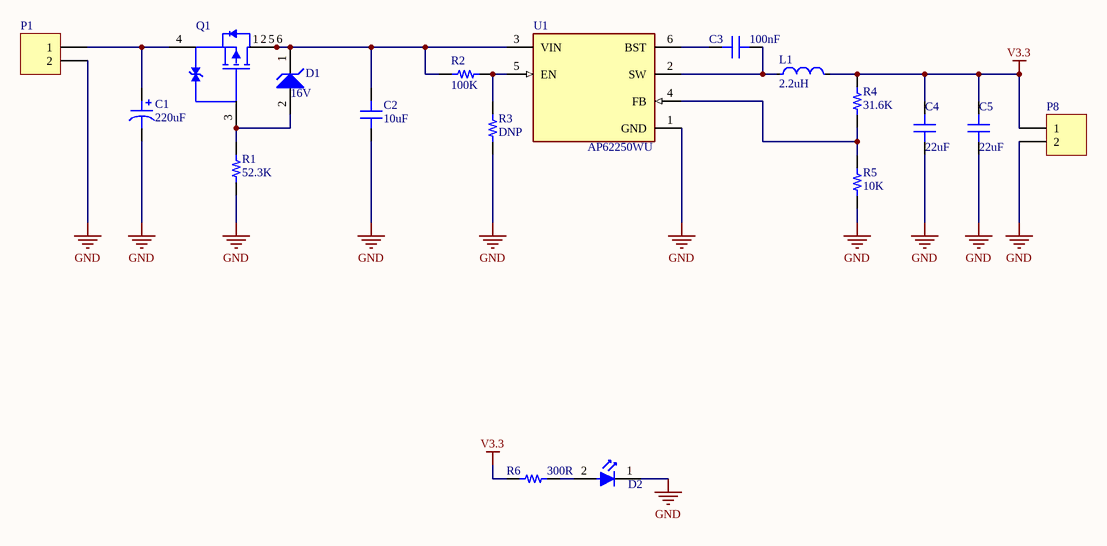
[diagram p4: buck_converter.SchDoc]

### Parts
C1  220uF  [CAP TH ALUM ELEC D10.00mm S5.00mm H12.50mm]
C2  10uF  [CAP 0603_1608]
C3  100nF  [CAP 0603_1608]
C4  22uF  [CAP 0603_1608]
C5  22uF  [CAP 0603_1608]
D1  16V  [Diodes_SOD-123_0]
D2  Red  [Würth_Elektronik_0_MFG]  (value not drawn)
L1  2.2uH  [Vishay_IHLP-2020CZ-FP_1_905x2_79-3D_3_0_MFG]
P1  *  [TEConn_EP2.5_1x2]  (value not drawn)
P8  DNP  [HDR1X2]  (value not drawn)
Q1  P Mosfet  [Diodes_Inc._TSOT26_MFG]  (value not drawn)
R1  52.3K  [RES 0603_1608]
R2  100K  [RES 0603_1608]
R3  DNP  [RES 0603_1608]
R4  31.6K  [RES 0603_1608]
R5  10K  [RES 0603_1608]
R6  300R  [RES 0603_1608]
U1  AP62250WU  [Diodes_Inc._TSOT26_MFG]

### Nets
GND: C1.2 C2.2 C4.2 C5.2 D2.1(C) P1.2 P8.2 R1.2 R3.2 R5.2 U1.1(GND)
V3.3: C4.1 C5.1 L1.2 P8.1 R4.1 R6.1
NetC1_1: C1.1 P1.1 Q1.4(S)
NetC2_1: C2.1 D1.1(K) Q1.1(D) Q1.2(D) Q1.5(D) Q1.6(D) R2.2 U1.3(VIN)
NetC3_1: C3.1 U1.6(BST)
NetC3_2: C3.2 L1.1 U1.2(SW)
NetD1_2: D1.2(A) Q1.3(G) R1.1
NetD2_2: D2.2(A) R6.2
NetR2_1: R2.1 R3.1 U1.5(EN)
NetR4_2: R4.2 R5.1 U1.4(FB)

### Notes on the sheet
- Title
- Size:
- Date:
- A4
- Number:
- Time:
- Revision:
- Sheet
- of
- File:

### Library data of the parts
C1 = Polarised Capacitor: SMT Polarised Capacitor; MF: KEMET; MP: ESK227M035AH1AA; Value: 220uF; Link: https://www.mouser.com/ProductDetail/KEMET/ESH227M050AH1AA?qs=w9hhVRgtvfmnb2YOvt619g%3D%3D
C2 = Capacitor: as C42 on sheet microcontroller; Value: 10uF; Link: https://www.mouser.com/ProductDetail/Murata-Electronics/GRM188R61C106MAALD?qs=hNud%2FORuBR3LEOKZ4RJp9w%3D%3D
C3 = Capacitor: as C30 on sheet microcontroller; Value: 100nF; Link: https://www.mouser.com/ProductDetail/TDK/CGA3E2X7R1E104K080AA?qs=NRhsANhppD%2Fm7%2FOmmsm0vg%3D%3D
C4 C5 = Capacitor: as C100 on sheet ultra_wideband; Value: 22uF; Link: https://www.mouser.com/ProductDetail/Murata-Electronics/GRM188R61A226ME15D?qs=eeBpzGFlv%252B8DV%2FrilzyhAw%3D%3D
D1 = Zener Diode: Zener Voltage Regulator; Manufacturer: On Semiconductor; Packing: Tape and Reel; P Max (W): 0.5; VZ Typ (V): 4.7; MF: Onsemi; MP: MMSZ5246BT1G; ComponentLink1Description: Manufacturer URL; ComponentLink2Description: Datasheet; DatasheetVersion: Rev. 12; ComponentLink3URL: http://www.onsemi.com/pub_link/Collateral/425-04.PDF; ComponentLink3Description: Package Specification; ComponentLink1URL: http://www.onsemi.com/; ComponentLink2URL: http://www.onsemi.com/pub_link/Collateral/MMSZ5221BT1-D.PDF; PackageVersion: Rev. G, 10/2009; PackageReference: SOD-123-2-425-04; PackageDescription: 2-Pin SOD, Body 1.6 x 2.69 mm; Mounting Technology: Surface Mount; RoHS: Pb-Free; Value: 16V; Link: https://www.mouser.com/ProductDetail/onsemi/MMSZ5246BT1G?qs=P4IOph%252Bbot93aqBP107C%2FQ%3D%3D
D2 = LED SMD: as D4 on sheet microcontroller; Value: Red; Link: https://www.mouser.com/ProductDetail/Lite-On/LTST-C190KRKT?qs=kAD5fFa1n5VY3YYNWPC1Fg%3D%3D
L1 = Inductor_sm: Fixed Inductors 2.2uH 20% High Temp AEC-Q200; MF: Vishay; MP: IHLP2020CZER2R2M11; Value: 2.2uH; Link: https://www.mouser.com/ProductDetail/Vishay-Dale/IHLP2020CZER2R2M11?qs=6luCnr706CzLTrsnHEyf2A%3D%3D
P1 = Header 2H: Header, 2-Pin, Right Angle; MF: TE Connectivity; MP: 1744426-2; LatestRevisionDate: 17-Jul-2002; LatestRevisionNote: Re-released for DXP Platform.; Publisher: Altium Limited; Value: *; Link: https://www.mouser.com/ProductDetail/TE-Connectivity-AMP/1744426-2?qs=IGPQaF7TU6sqa55bZxfMjA%3D%3D
P8 = Header 2: Header, 2-Pin; LatestRevisionDate: 17-Jul-2002; LatestRevisionNote: Re-released for DXP Platform.; Publisher: Altium Limited; Value: DNP; Link: https://
Q1 = Mosfet-P-6_ESD: P-Channel Enhancement Mode MOS Transistor, 3-Pin SOT23; MF: Vishay; MP: SI3421DV-T1-GE3; Value: P Mosfet; Link: https://www.mouser.com/ProductDetail/Vishay-Semiconductors/SI3421DV-T1-GE3?qs=dpt6vIvaxwjvmZPXyyVpRg%3D%3D
R1 = Resistor: SMT Resistor; MF: YAGEO; MP: AC0603FR-0752K3L; Value: 52.3K; Link: https://www.mouser.com/ProductDetail/YAGEO/AC0603FR-0752K3L?qs=ygRr%2Ftkhtes52vQmIU4puQ%3D%3D
R2 R3 = Resistor: as R53 on sheet ultra_wideband; Link: https://www.mouser.com/ProductDetail/YAGEO/AC0603FR-07100KL?qs=UoPT7wUmgYKBKZ83mTH%252BSA%3D%3D
  R2: Value: 100K
  R3: Value: DNP
R4 = Resistor: SMT Resistor; MF: YAGEO; MP: AC0603FR-0731K6L; Value: 31.6K; Link: https://www.mouser.com/ProductDetail/YAGEO/AC0603FR-0731K6L?qs=sGAEpiMZZMvdGkrng054t7zOzNqIRvGcLu2vFpoTK4k%3D
R5 = Resistor: as R25 on sheet microcontroller; Value: 10K; Link: https://www.mouser.com/ProductDetail/YAGEO/AC0603FR-0710KL?qs=UoPT7wUmgYKz3zh0UDMA4Q%3D%3D
R6 = Resistor: as R30 on sheet microcontroller; Value: 300R; Link: https://www.mouser.com/ProductDetail/YAGEO/AC0603FR-07300RL?qs=yhV1fb9g%2FKYRCKndxB9juA%3D%3D
U1 = AP62250WU: Switching Voltage Regulators DCDC Conv HV Buck TSOT26; MF: Diodes Incorporated; MP: AP62250WU-7; Link: https://www.mouser.com/ProductDetail/Diodes-Incorporated/AP62250WU-7?qs=7MVldsJ5Uax1PUc8sdeimQ%3D%3D

## Sheet environmental_sensor.SchDoc
size 297 x 209 mm; DrawnBy: Supun; Engineer: Supun; Organization: C3
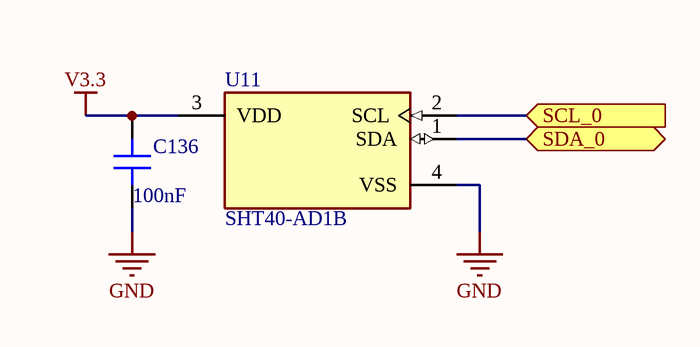
[diagram p5: environmental_sensor.SchDoc]

### Parts
C136  100nF  [CAP 0603_1608]
U11  SHT40-AD1B  [Sensirion_3_MFG]

### Ports
SCL_0 (in), SDA_0 (bidir)

### Nets
GND: C136.2 U11.4(VSS)
V3.3: C136.1 U11.3(VDD)
SCL_1: U11.2(SCL) ; port SCL_0
SDA_1: U11.1(SDA) ; port SDA_0

### Notes on the sheet
- Title
- Size:
- Date:
- A4
- Number:
- Time:
- Revision:
- Sheet
- of
- File:

### Library data of the parts
C136 = Capacitor: as C30 on sheet microcontroller; Value: 100nF; Link: https://www.mouser.com/ProductDetail/TDK/CGA3E2X7R1E104K080AA?qs=NRhsANhppD%2Fm7%2FOmmsm0vg%3D%3D
U11 = SHT40-AD1B: Board Mount Humidity Sensors Humidity and Temperature Sensor; MF: Sensirion; MP: SHT40-AD1B-R3; Value: *; Link: https://www.mouser.com/ProductDetail/Sensirion/SHT40-AD1B-R3?qs=zW32dvEIR3sa7U6cFW6pBw%3D%3D

## Nets that join several sheets
GND: microcontroller (26 pins), ultra_wideband (44 pins), ethernet (29 pins), buck_converter (11 pins), environmental_sensor (C136.2 U11.4)
V3.3: microcontroller (24 pins), ultra_wideband (12 pins), ethernet (8 pins), buck_converter (6 pins), environmental_sensor (C136.1 U11.3)
ETH_CS: microcontroller (U4.12), ethernet (U9.29)
ETH_INT: microcontroller (U4.11), ethernet (U9.47)
ETH_RST: microcontroller (U4.16), ethernet (R72.1 U9.48)
MISO_0: microcontroller (U4.2), ultra_wideband (U7.40)
MISO_1: microcontroller (U4.15), ethernet (U9.33)
MOSI_0: microcontroller (U4.5), ultra_wideband (U7.39)
MOSI_1: microcontroller (U4.14), ethernet (U9.32)
SCK_0: microcontroller (U4.4), ultra_wideband (U7.41)
SCK_1: microcontroller (U4.13), ethernet (U9.30)
SCL_1: microcontroller (R28.1 U4.18), environmental_sensor (U11.2)
SDA_1: microcontroller (R29.1 U4.17), environmental_sensor (U11.1)
UWB_CS: microcontroller (U4.3), ultra_wideband (U7.24)
UWB_IRQ: microcontroller (U4.7), ultra_wideband (R53.2 U7.45)
UWB_RST: microcontroller (U4.6), ultra_wideband (U7.27)